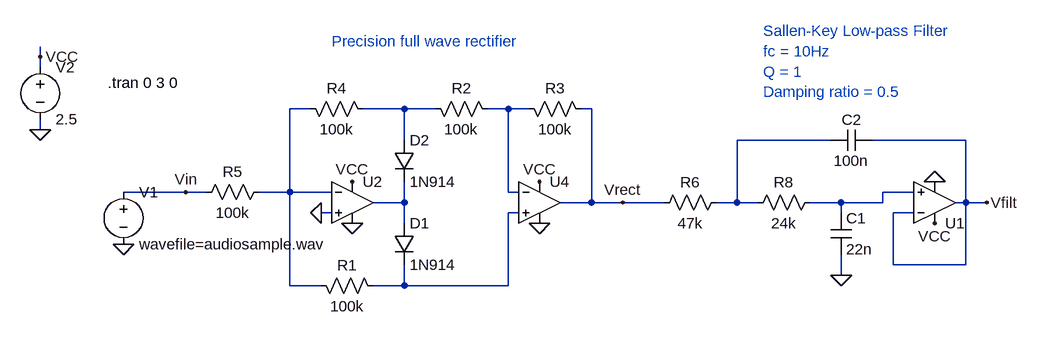
[diagram p0: schematic LTSPICE Simulation.asc]
LTSPICE Simulation.asc, the LTspice schematic file:
Version 4
SHEET 1 1700 680
WIRE -80 112 -80 96
WIRE -80 128 -80 112
WIRE 336 192 304 192
WIRE 480 192 416 192
WIRE 528 192 480 192
WIRE 640 192 608 192
WIRE 672 192 640 192
WIRE 768 192 752 192
WIRE -80 224 -80 208
WIRE 480 240 480 192
WIRE 1136 240 992 240
WIRE 1344 240 1200 240
WIRE 144 320 48 320
WIRE 176 320 144 320
WIRE 304 320 304 192
WIRE 304 320 256 320
WIRE 368 320 304 320
WIRE 640 320 640 192
WIRE 656 320 640 320
WIRE 1264 320 1216 320
WIRE 480 336 480 304
WIRE 480 336 432 336
WIRE 768 336 768 192
WIRE 768 336 720 336
WIRE 816 336 768 336
WIRE 880 336 816 336
WIRE 992 336 992 240
WIRE 992 336 960 336
WIRE 1024 336 992 336
WIRE 1152 336 1104 336
WIRE 1216 336 1216 320
WIRE 1216 336 1152 336
WIRE 1344 336 1344 240
WIRE 1344 336 1328 336
WIRE 1376 336 1344 336
WIRE 368 352 352 352
WIRE 656 352 640 352
WIRE 1152 352 1152 336
WIRE 1264 352 1232 352
WIRE 480 368 480 336
WIRE 1232 432 1232 352
WIRE 1344 432 1344 336
WIRE 1344 432 1232 432
WIRE 1152 448 1152 416
WIRE 304 464 304 320
WIRE 352 464 304 464
WIRE 480 464 480 432
WIRE 480 464 432 464
WIRE 640 464 640 352
WIRE 640 464 480 464
FLAG 48 400 0
FLAG -80 224 0
FLAG 144 320 Vin
FLAG 816 336 Vrect
FLAG -80 112 VCC
FLAG 400 304 VCC
FLAG 688 304 VCC
FLAG 1152 448 0
FLAG 1296 368 VCC
FLAG 1376 336 Vfilt
FLAG 1296 304 0
FLAG 400 368 0
FLAG 688 368 0
FLAG 352 352 0
SYMBOL voltage 48 304 R0
SYMATTR InstName V1
SYMATTR Value wavefile=audiosample.wav
SYMBOL voltage -80 112 R0
WINDOW 123 0 0 Left 0
WINDOW 39 0 0 Left 0
SYMATTR InstName V2
SYMATTR Value 2.5
SYMBOL res 448 480 M270
WINDOW 0 32 56 VTop 2
WINDOW 3 0 56 VBottom 2
SYMATTR InstName R1
SYMATTR Value 100k
SYMBOL res 432 208 M270
WINDOW 0 32 56 VTop 2
WINDOW 3 0 56 VBottom 2
SYMATTR InstName R4
SYMATTR Value 100k
SYMBOL res 272 304 R90
WINDOW 0 0 56 VBottom 2
WINDOW 3 32 56 VTop 2
SYMATTR InstName R5
SYMATTR Value 100k
SYMBOL res 768 208 M270
WINDOW 0 32 56 VTop 2
WINDOW 3 0 56 VBottom 2
SYMATTR InstName R3
SYMATTR Value 100k
SYMBOL res 624 208 M270
WINDOW 0 32 56 VTop 2
WINDOW 3 0 56 VBottom 2
SYMATTR InstName R2
SYMATTR Value 100k
SYMBOL Opamps\\UniversalOpamp2 400 336 R0
SYMATTR InstName U2
SYMBOL Opamps\\UniversalOpamp2 688 336 R0
SYMATTR InstName U4
SYMBOL res 976 320 R90
WINDOW 0 0 56 VBottom 2
WINDOW 3 32 56 VTop 2
SYMATTR InstName R6
SYMATTR Value 47k
SYMBOL res 1120 320 R90
WINDOW 0 0 56 VBottom 2
WINDOW 3 32 56 VTop 2
SYMATTR InstName R8
SYMATTR Value 24k
SYMBOL cap 1136 352 R0
SYMATTR InstName C1
SYMATTR Value 22n
SYMBOL cap 1200 224 R90
WINDOW 0 0 32 VBottom 2
WINDOW 3 32 32 VTop 2
SYMATTR InstName C2
SYMATTR Value 100n
SYMBOL Opamps\\UniversalOpamp2 1296 336 M180
SYMATTR InstName U1
SYMBOL diode 464 368 R0
SYMATTR InstName D1
SYMATTR Value 1N914
SYMBOL diode 464 240 R0
SYMATTR InstName D2
SYMATTR Value 1N914
TEXT 24 152 Left 2 !.tran 0 3 0
TEXT 1032 72 Left 2 ;Sallen-Key Low-pass Filter\nfc = 10Hz\nQ = 1\nDamping ratio = 0.5
TEXT 368 88 Left 2 ;Precision full wave rectifier

The netlist it stands for:
* LTSPICE Simulation.asc
V1 Vin 0 wavefile=audiosample.wav
V2 VCC 0 2.5
R1 N007 N001 100k
R4 N002 N001 100k
R5 N001 Vin 100k
R3 Vrect N003 100k
R2 N003 N002 100k
XU2 0 N001 VCC 0 N006 level.2 Avol=1Meg GBW=10Meg Slew=10Meg ilimit=25m rail=0 Vos=0 phimargin=45 en=0 enk=0 in=0 ink=0 Rin=500Meg  ; pins IN+ IN- V+ V- OUT
XU4 N007 N003 VCC 0 Vrect level.2 Avol=1Meg GBW=10Meg Slew=10Meg ilimit=25m rail=0 Vos=0 phimargin=45 en=0 enk=0 in=0 ink=0 Rin=500Meg  ; pins IN+ IN- V+ V- OUT
R6 N004 Vrect 47k
R8 N005 N004 24k
C1 N005 0 22n
C2 Vfilt N004 100n
XU1 N005 Vfilt VCC 0 Vfilt level.2 Avol=1Meg GBW=10Meg Slew=10Meg ilimit=25m rail=0 Vos=0 phimargin=45 en=0 enk=0 in=0 ink=0 Rin=500Meg  ; pins IN+ IN- V+ V- OUT
D1 N006 N007 1N914
D2 N002 N006 1N914
.model D D
.lib standard.dio
.tran 0 3 0
* Sallen-Key Low-pass Filter
* fc = 10Hz
* Q = 1
* Damping ratio = 0.5
* Precision full wave rectifier
.lib UniversalOpamps2.sub
.backanno
.end